# EAGLE design Mabee_Slide Potentimeter V1.1 (EAGLE 6.1)
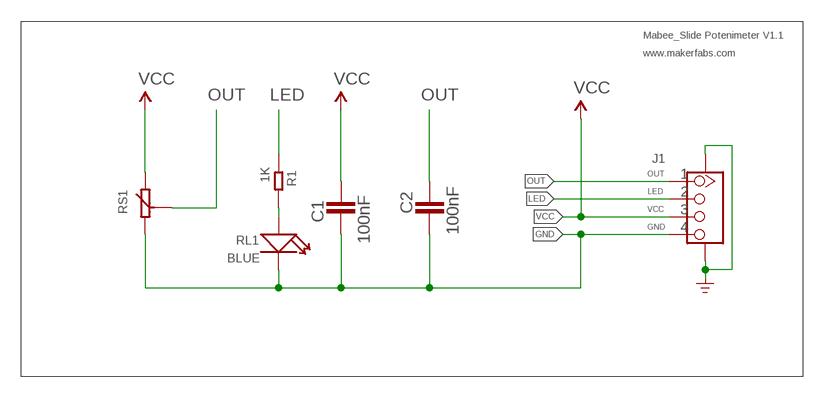
[diagram p0: schematic, sheet 1]

## Parts
C1  100nF  C-EUC0603  [C0603]
C2  100nF  C-EUC0603  [C0603]
J1  GROVE-CONNECTOR-SMD'90D'  [HW4-SMD-2.0-90D]
R1  1K  R-0603  [R0603]
RL1  BLUE  LED'0603'  [LED-0603]
RS1  R_SLIDE  [R_SLIDE_DPT]

## Nets
GND: C1.1 C2.1 J1.4 J1.SS1 J1.SS2 RL1.- RS1.3
LED: J1.2 R1.1
N$3: R1.2 RL1.+
OUT: C2.2 J1.1 RS1.2
VCC: C1.2 J1.3 RS1.1

## Notes on the sheet
- Mabee_Slide Potenimeter V1.1
- www.makerfabs.com

## Library data of the parts
C1 C2 = rcl:C-EU: CAPACITOR, European symbol
J1 = Connector-new:GROVE-CONNECTOR-SMD: 4P-SMD-2.0:320110030;4P-SMD-2.0-90D:320110032
R1 = Discrete:R*
RL1 = Discrete:LED*
RS1 = 1mytest:R_SLIDE

## Net classes
0 default: width 0.203 mm, drill 0.305 mm, clearance 0.152 mm

## Board
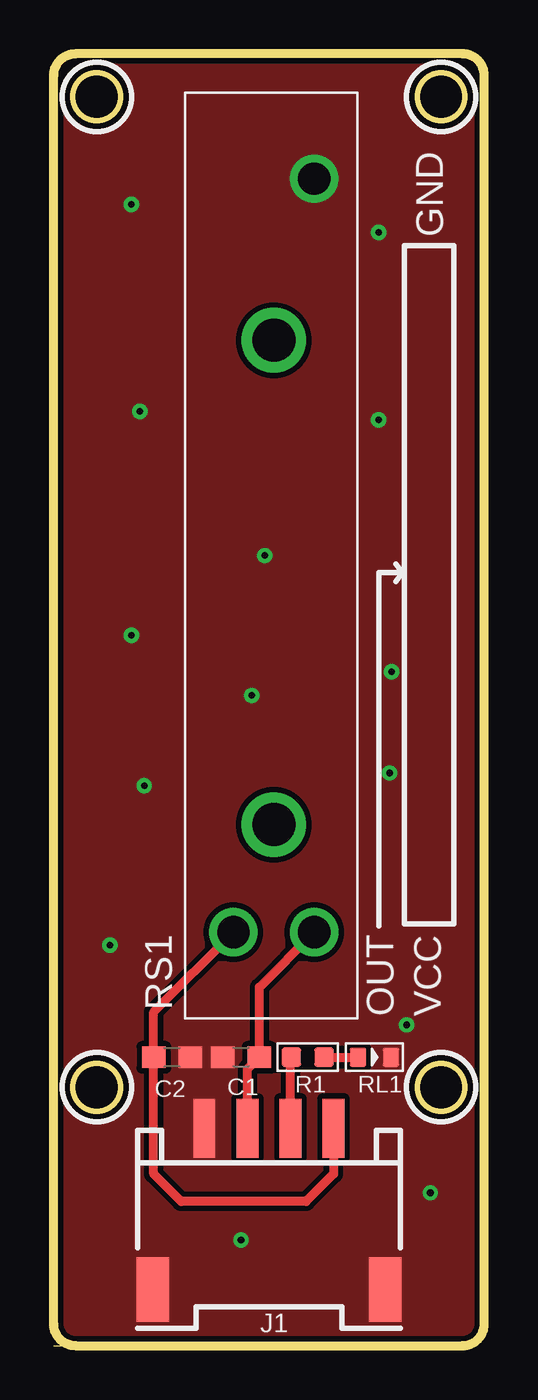
[diagram p1: board, top side]
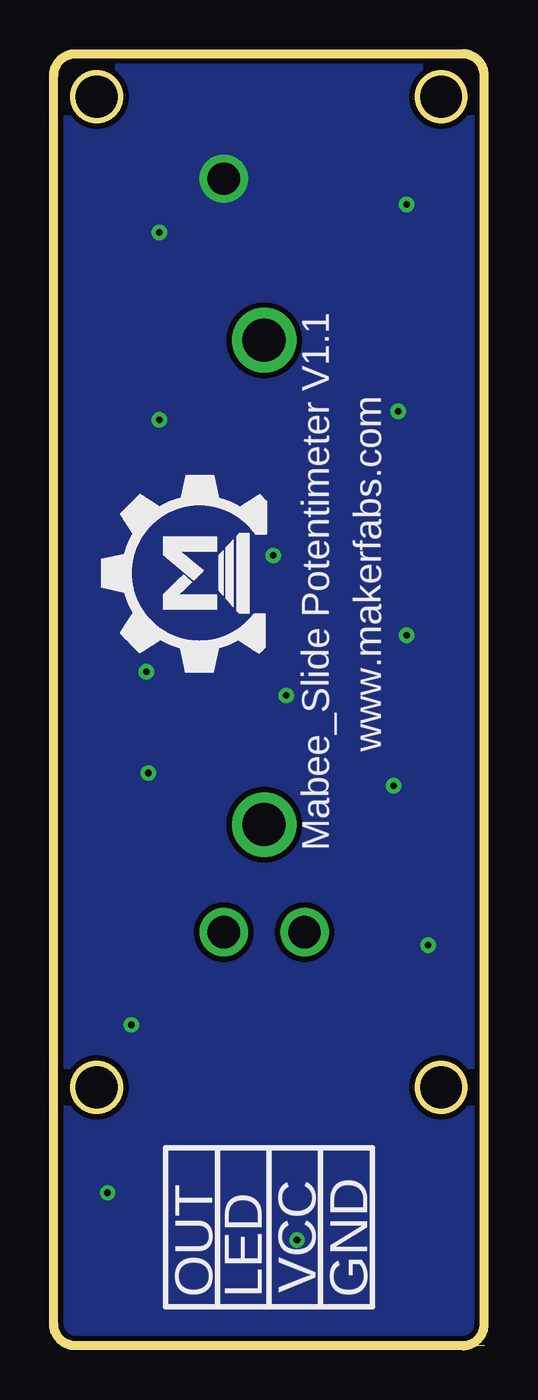
[diagram p2: board, bottom side, seen from below]

Size 20 x 60 mm. Coordinates in mm from the lower left corner, seen from the top.
Outline: 0,0 1,0
Outline: 1,0 arc-90 0,1 0,59 arc-90 1,60 19,60 arc-90 20,59 20,1 arc-90 19,0 1,0
Outline: circle at 2,12 radius 1.1
Outline: circle at 18,12 radius 1.1
Outline: circle at 2,58 radius 1.1
Outline: circle at 18,58 radius 1.1
Copper layers (1*16): Top 0.035mm / dielectric 1.5mm / Bottom 0.035mm
Design rules: minimum track width 10mil, minimum drill 24mil, track to track 8mil, track to pad 8mil, pad to pad 8mil, via to via 8mil, smd to smd 8mil, copper to edge 10mil, drill to drill 8mil, minimum pad ring 10mil, minimum via ring 8mil, stop-mask expansion 4mil, vias tented up to drill 100mil, thermal gap 0mil

### Footprints (pad centres in the part's own frame; a part is rotated, then mirrored left to right if it is on the bottom)
C0603 = smd 1.1 x 1: 1 -0.85,0; 2 0.85,0
HW4-SMD-2.0-90D = smd 1.01 x 2.74: 1 -3,-0.1; 2 -1,-0.1; 3 1,-0.1; 4 3,-0.1 | smd 1.5 x 3: SS1 -5.4,7.4; SS2 5.4,7.4
R0603 = smd 0.889 x 0.889: 1 -0.762,0; 2 0.762,0
LED-0603 = smd 0.762 x 0.889: + -0.762,0; - 0.762,0
R_SLIDE_DPT = drill 1.5: 1 0,0; 2 0,3.75; 3 35,0 | drill 2: P$1 5,1.875; P$2 27.5,1.875

### Placement (x,y rotation side)
C1  8.7,13.4 0 top
C2  5.5,13.4 180 top
J1  10,10 180 top
R1  11.8,13.4 0 top
RL1  14.9,13.4 0 top
RS1  12.1,19.2 90 top
U$2  [MAKERFABS_0.3]  10.16,31.76 90 bottom

### Tracks (layer width: path | path; a pad name or v marks a point on that pad's centre or on a via)
GND  (via drill 0.3)
  other vias: 3.6,53 15.1,51.7 4,43.4 15.1,43 9.8,36.7 3.6,33 15.7,31.3 9.2,30.2 4.2,26 15.6,26.6 2.6,18.6 16.4,14.9 17.5,7.1 8.7,4.9
  pour Top (isolate 0.254, no thermals): -1.4,13.2 -1.4,0.07 -0.13,-1.2 9.4,-1.2 19.93,-1.2 21.2,0.07 21.2,19.2 21.2,60.13 19.93,61.4 9.2,61.4 -0.13,61.4 -1.4,60.13
  pour Bottom (isolate 0.254): -1.8,16 -1.8,-0.73 -0.53,-2 10.2,-2 20.73,-2 22,-0.73 22,39.4 22,60.93 20.73,62.2 8.6,62.2 -0.53,62.2 -1.8,60.93
LED
  Top 0.406: J1.2 11,13.36 R1.1
N$3
  Top 0.406: R1.2 RL1.+
OUT
  Top 0.406: J1.1 13,7.97 11.73,6.7 5.92,6.7 4.65,7.97 C2.2 4.65,15.5 RS1.2
VCC
  Top 0.406: J1.3 9,12.85 C1.2 9.55,16.65 RS1.1

### Text on the board
tPlace: GND | OUT | VCC
bPlace: www.makerfabs.com | Mabee_Slide Potentimeter V1.1
bNames: GND | VCC | OUT | LED